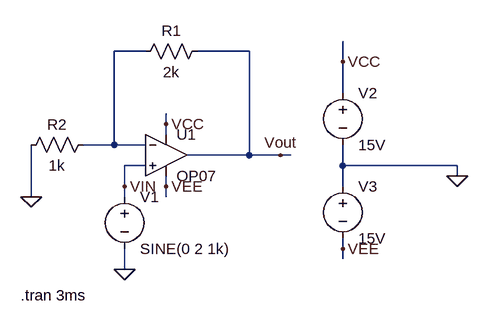
[diagram p0: schematic non_inverting_ltspice.asc]
non_inverting_ltspice.asc, the LTspice schematic file:
Version 4
SHEET 1 880 680
WIRE 80 0 32 0
WIRE 240 0 160 0
WIRE 384 16 384 -16
WIRE 384 64 384 16
WIRE 112 112 112 96
WIRE 112 128 112 112
WIRE 32 144 32 0
WIRE 32 144 -16 144
WIRE 80 144 32 144
WIRE 240 160 240 0
WIRE 240 160 144 160
WIRE 288 160 240 160
WIRE 304 160 288 160
WIRE 80 176 48 176
WIRE 384 176 384 144
WIRE 560 176 384 176
WIRE 560 192 560 176
WIRE 48 208 48 176
WIRE 112 208 112 192
WIRE 384 208 384 176
WIRE -96 224 -96 144
WIRE 48 224 48 208
WIRE 112 224 112 208
WIRE 384 304 384 288
WIRE 384 320 384 304
WIRE 48 336 48 304
FLAG -96 224 0
FLAG 48 336 0
FLAG 48 208 VIN
FLAG 288 160 Vout
FLAG 112 208 VEE
FLAG 384 304 VEE
FLAG 560 192 0
FLAG 112 112 VCC
FLAG 384 16 VCC
SYMBOL OpAmps\\OP07 112 96 R0
SYMATTR InstName U1
SYMBOL res 176 -16 R90
WINDOW 0 0 56 VBottom 2
WINDOW 3 32 56 VTop 2
SYMATTR InstName R1
SYMATTR Value 2k
SYMBOL res 0 128 R90
WINDOW 0 0 56 VBottom 2
WINDOW 3 32 56 VTop 2
SYMATTR InstName R2
SYMATTR Value 1k
SYMBOL voltage 48 208 R0
WINDOW 123 0 0 Left 0
WINDOW 39 0 0 Left 0
SYMATTR InstName V1
SYMATTR Value SINE(0 2 1k)
SYMBOL voltage 384 48 R0
SYMATTR InstName V2
SYMATTR Value 15V
SYMBOL voltage 384 192 R0
SYMATTR InstName V3
SYMATTR Value 15V
TEXT -112 376 Left 2 !.tran 3ms

The netlist it stands for:
* non_inverting_ltspice.asc
XU1 VIN N001 VCC VEE Vout LT1001  ; OP07, pins In+ In- V+ V- OUT
R1 Vout N001 2k
R2 N001 0 1k
V1 VIN 0 SINE(0 2 1k)
V2 VCC 0 15V
V3 0 VEE 15V
.tran 3ms
.lib LTC.lib
.backanno
.end